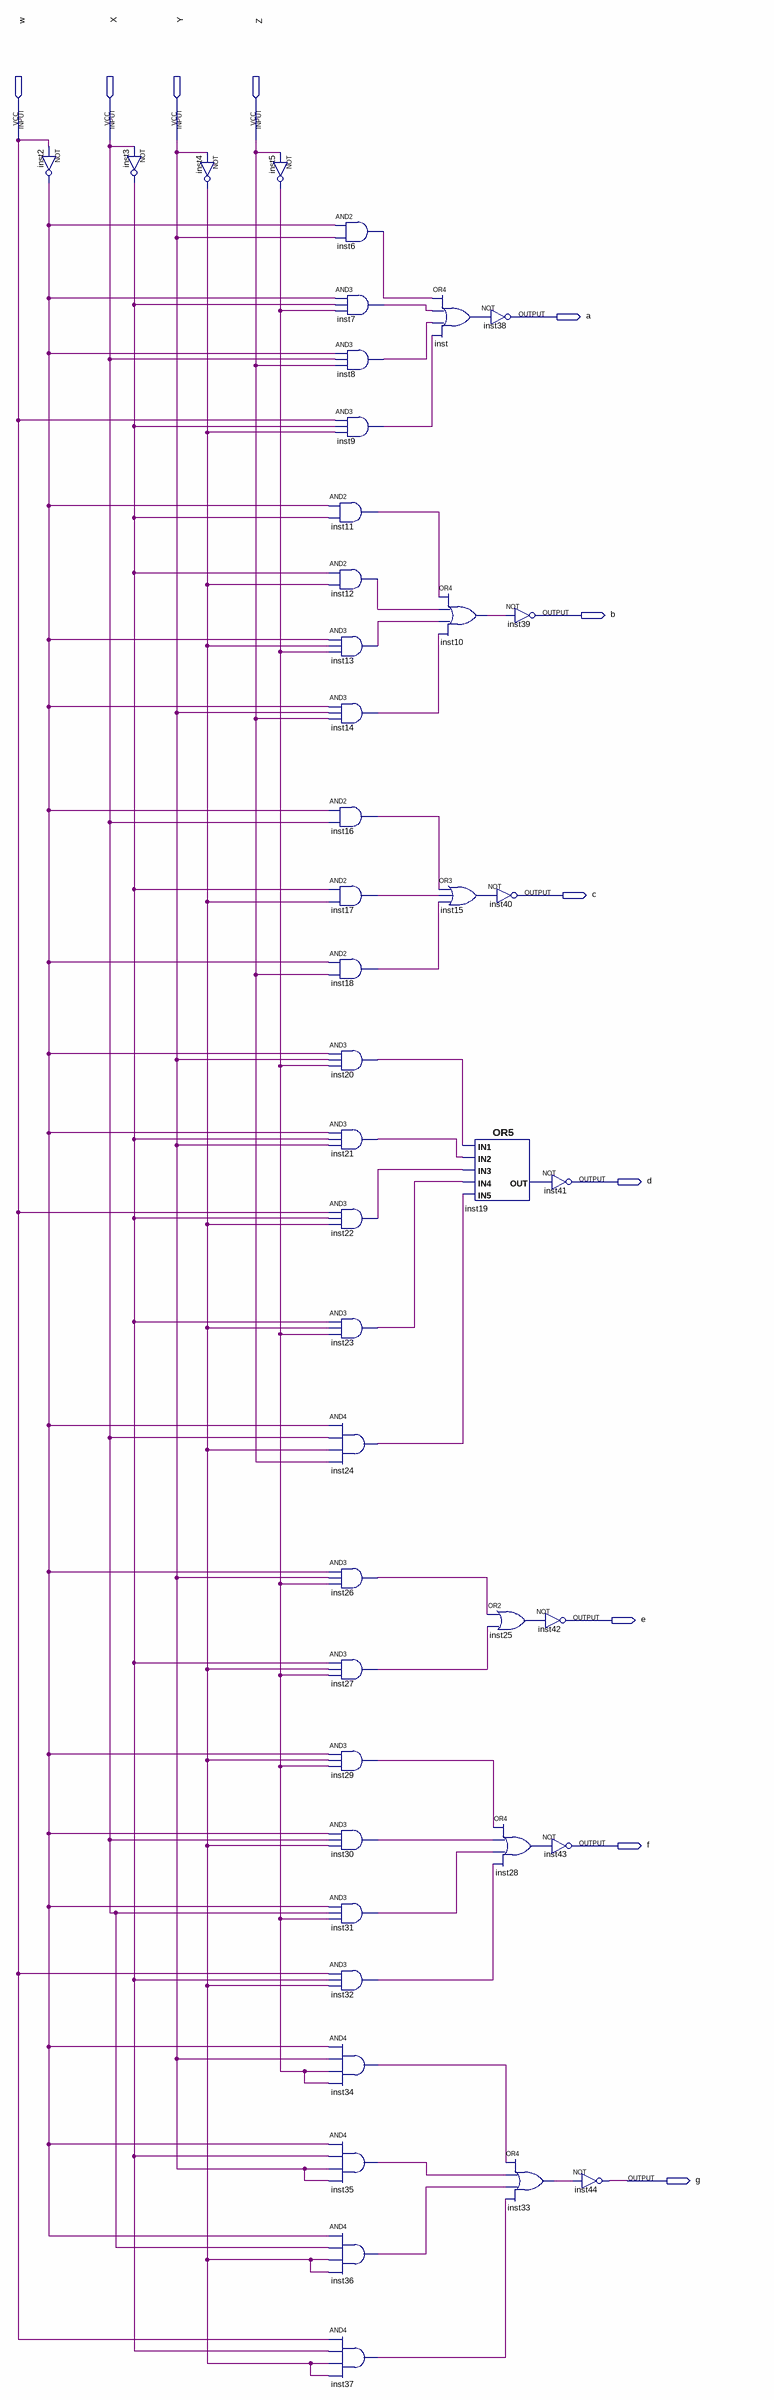
[diagram p0: schematic sheet]
// Quartus schematic displaysete.bdf as structural Verilog: 44 symbols, 11 pins
module displaysete (
  input  w,
  input  X,
  input  Y,
  input  Z,
  output a,
  output b,
  output c,
  output d,
  output e,
  output f,
  output g
);

  wire inst2_out, inst3_out, inst4_out, inst5_out, inst6_out, inst7_out, inst8_out, inst9_out, inst10_out,
       inst11_out, inst12_out, inst13_out, inst14_out, inst15_out, inst16_out, inst17_out, inst18_out,
       inst19_out, inst20_out, inst21_out, inst22_out, inst23_out, inst24_out, inst25_out, inst26_out,
       inst27_out, inst28_out, inst29_out, inst30_out, inst31_out, inst32_out, inst33_out, inst34_out,
       inst35_out, inst36_out, inst37_out, inst_out;

  not inst2 (inst2_out, w);
  not inst3 (inst3_out, X);
  not inst4 (inst4_out, Y);
  not inst5 (inst5_out, Z);
  and inst6 (inst6_out, inst2_out, Y);
  and inst7 (inst7_out, inst2_out, inst3_out, inst5_out);
  and inst8 (inst8_out, inst2_out, X, Z);
  and inst9 (inst9_out, w, inst3_out, inst4_out);
  and inst11 (inst11_out, inst2_out, inst3_out);
  and inst12 (inst12_out, inst3_out, inst4_out);
  and inst13 (inst13_out, inst2_out, inst4_out, inst5_out);
  and inst14 (inst14_out, inst2_out, Y, Z);
  and inst16 (inst16_out, inst2_out, X);
  and inst17 (inst17_out, inst3_out, inst4_out);
  and inst18 (inst18_out, inst2_out, Z);
  and inst20 (inst20_out, inst2_out, Y, inst5_out);
  and inst21 (inst21_out, inst2_out, inst3_out, Y);
  and inst22 (inst22_out, w, inst3_out, inst4_out);
  and inst23 (inst23_out, inst3_out, inst4_out, inst5_out);
  and inst24 (inst24_out, inst2_out, X, inst4_out, Z);
  and inst26 (inst26_out, inst2_out, Y, inst5_out);
  and inst27 (inst27_out, inst3_out, inst4_out, inst5_out);
  and inst29 (inst29_out, inst2_out, inst4_out, inst5_out);
  and inst30 (inst30_out, inst2_out, X, inst4_out);
  and inst31 (inst31_out, inst2_out, X, inst5_out);
  and inst32 (inst32_out, w, inst3_out, inst4_out);
  and inst34 (inst34_out, inst2_out, Y, inst5_out, inst5_out);
  and inst35 (inst35_out, inst2_out, inst3_out, Y, Y);
  and inst36 (inst36_out, inst2_out, X, inst4_out, inst4_out);
  and inst37 (inst37_out, w, inst3_out, inst4_out, inst4_out);
  or inst (inst_out, inst6_out, inst7_out, inst8_out, inst9_out);
  or inst10 (inst10_out, inst11_out, inst12_out, inst13_out, inst14_out);
  or inst15 (inst15_out, inst16_out, inst17_out, inst18_out);
  or inst19 (inst19_out, inst20_out, inst21_out, inst22_out, inst23_out, inst24_out);
  not inst38 (a, inst_out);
  not inst39 (b, inst10_out);
  not inst40 (c, inst15_out);
  or inst25 (inst25_out, inst26_out, inst27_out);
  or inst28 (inst28_out, inst29_out, inst30_out, inst31_out, inst32_out);
  or inst33 (inst33_out, inst34_out, inst35_out, inst36_out, inst37_out);
  not inst41 (d, inst19_out);
  not inst42 (e, inst25_out);
  not inst43 (f, inst28_out);
  not inst44 (g, inst33_out);
endmodule
